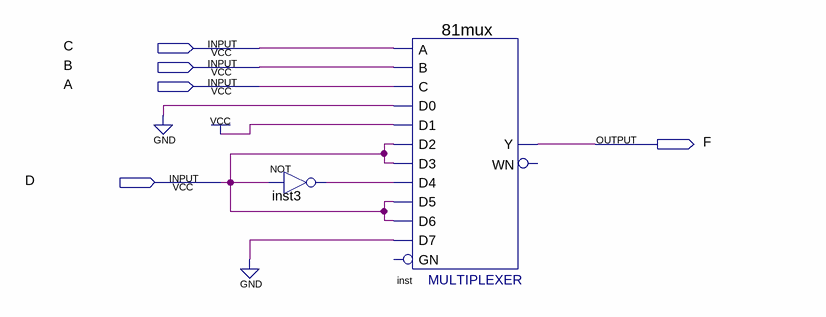
[diagram p0: schematic sheet]
// Quartus schematic Problema45.bdf as structural Verilog: 2 symbols, 5 pins
module Problema45 (
  input  C,
  input  B,
  input  A,
  input  D,
  output F
);

  wire inst3_out;

  not inst3 (inst3_out, D);
  \81mux  inst (
    .C(A), .D1(1'b1), .D0(1'b0), .D5(D), .D4(inst3_out), .D2(D), .D3(D), .D7(1'b0), .D6(D), .A(C), .B(B),
    .Y(F));  // open: GN, WN
endmodule
